# Altium schematic sheet BM1370_REFCLK.SchDoc
size A4; SheetNumber: 8; SheetTotal: 15
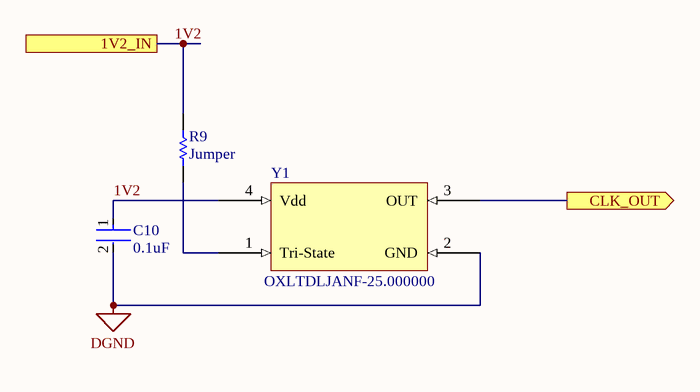
[diagram p0: BM1370_REFCLK.SchDoc]

## Parts
C10  value 0.1uF  [FP-CC0402-IPC_C]  (hidden comment: CC0402KRX7R7BB104)
R9  value Jumper  [FP-RK73Z1E-IPC_B]  (hidden comment: RK73Z1ETTP)
Y1  OXLTDLJANF-25.000000  [OXLTDLJANF-25.000000-Footprint-1]

## Ports
1V2_IN, CLK_OUT (out)

## Nets
DGND: C10.2 Y1.2(GND)
1V2: C10.1 R9.2 Y1.4(Vdd) ; port 1V2_IN
CLK_OUT: Y1.3(OUT) ; port CLK_OUT
NetR9_1: R9.1 Y1.1(Tri-State)

## Library data of the parts
C10 = CMP-001-00094-1: Multilayer Ceramic Capacitor, 0.1 uF, 25 V, ± 10%, X7R, 0402 [1005 Metric]; Rating: 16V; Reel Size: 8mm; Vendor: TTI; Category: Capacitor; Price: 0.004; Package: 0402; MOQ: 10000
R9 = CMP-x00147-1: Metal Glaze/thick Film, 0ohm, Surface Mount, 0402
Y1 = CMP-x00169-1: Xtal Osc Xo 25MHZ 1.2V Cmos SMD